# Altium project PCB_Project.PrjPcb
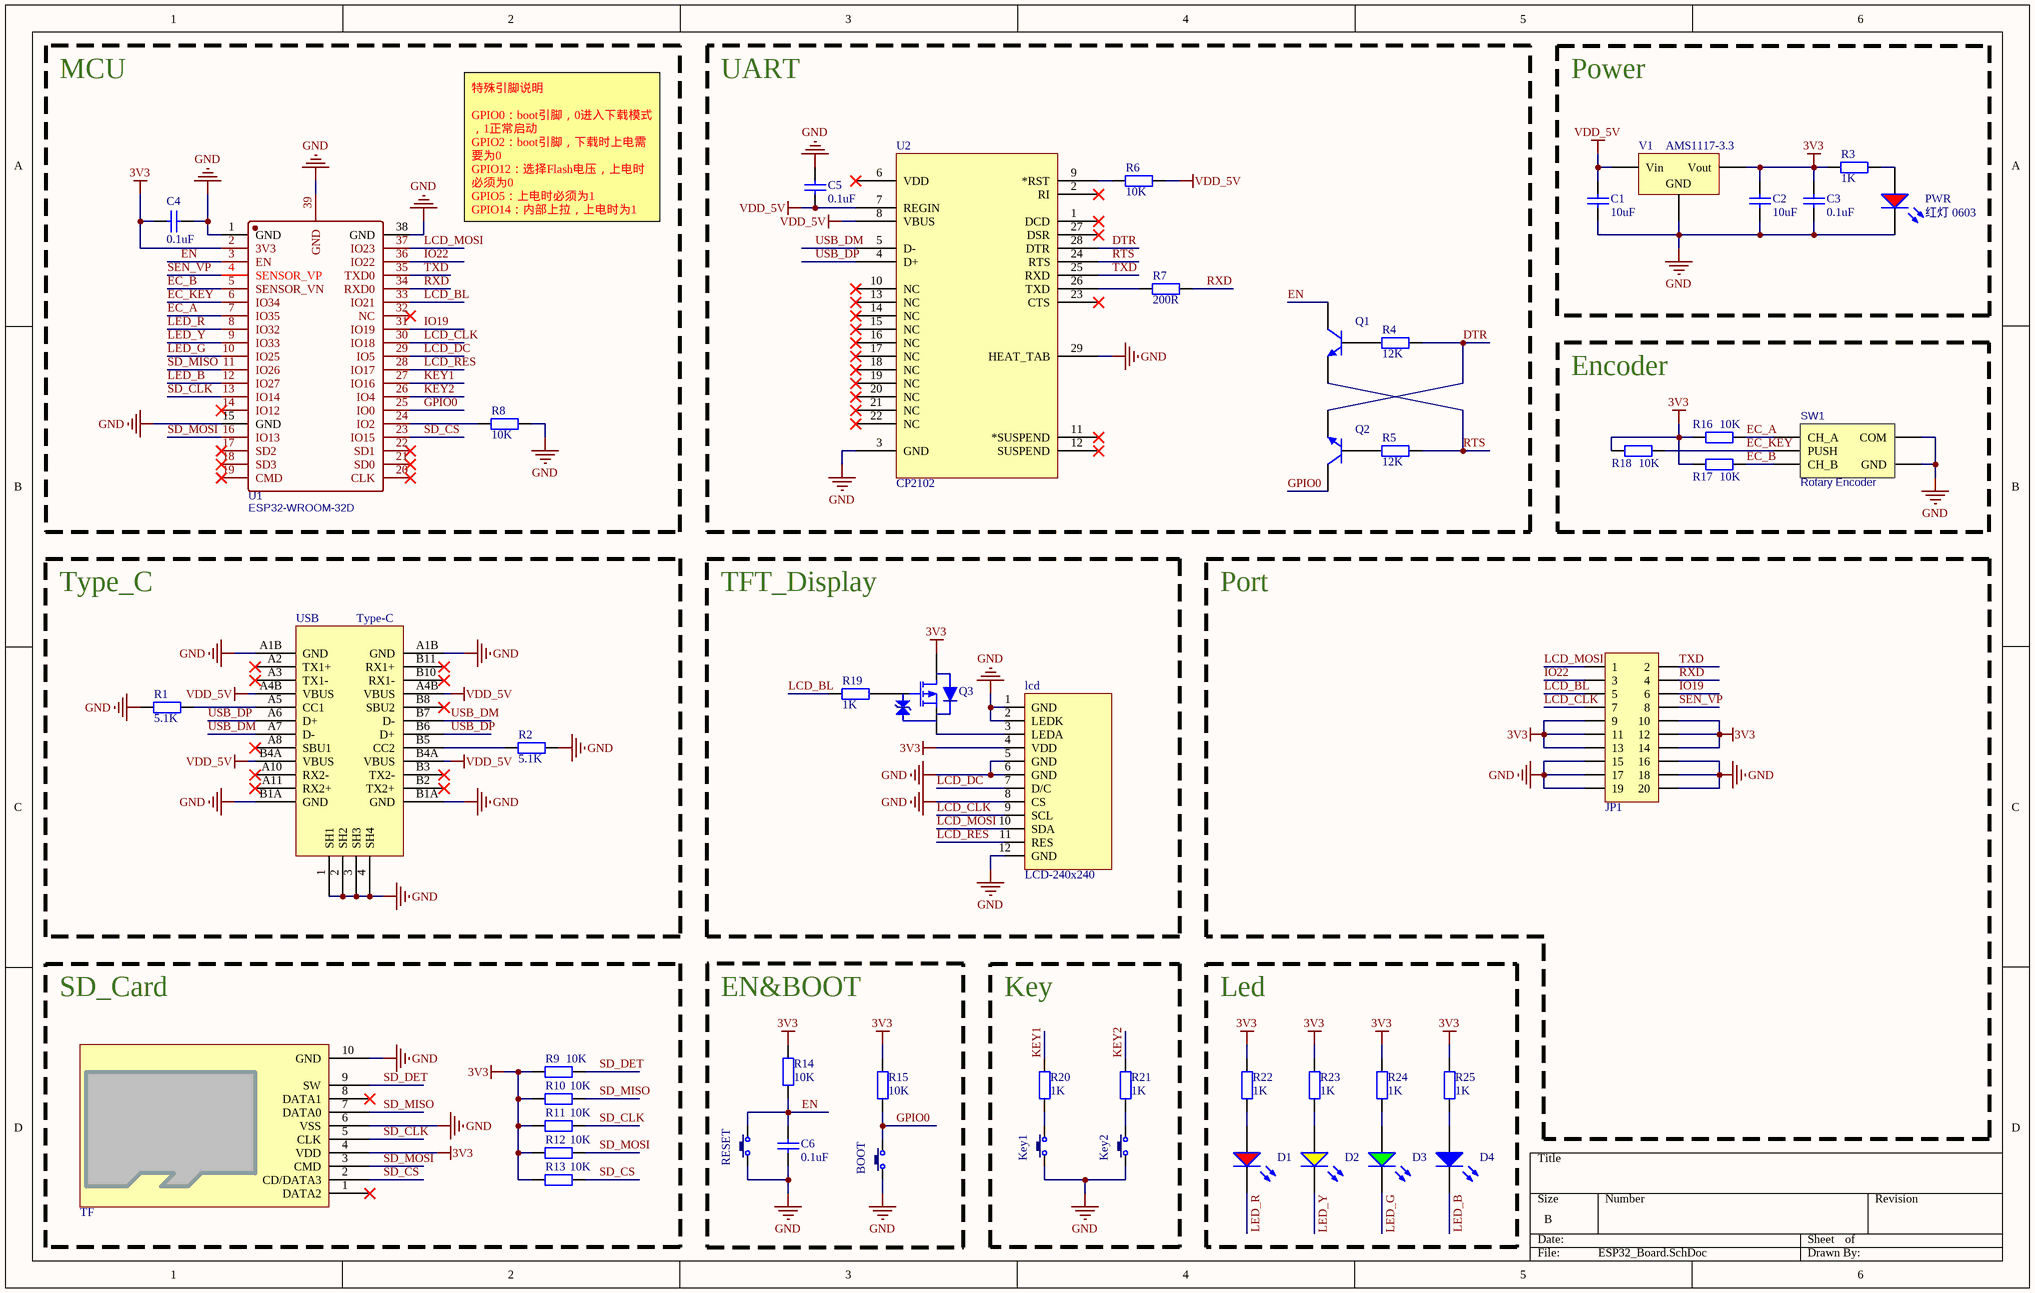
[diagram p0: ESP32_Board.SchDoc]
1 sheet, 51 parts. Net scope: global (net labels, ports and power ports of the same name join across sheets).
Board file: ESP32_Board_PCB.PcbDoc

## Sheet ESP32_Board.SchDoc
size B; SheetNumber: 1; SheetTotal: 1

### Parts
BOOT  3x6x5  [TSW SMD-6*6*5]  (value not drawn)
C1  10uF  [0603_C]
C2  10uF  [0603_C]
C3  0.1uF  [0603_C]
C4  0.1uF  [0603_C]
C5  0.1uF  [0603_C]
C6  0.1uF  [0603_C]
D1  红灯 0805  [0805_LED_S1]  (value not drawn)
D2  黄灯 0805  [0805_LED_S1]  (value not drawn)
D3  翠绿 0805  [0805_LED_S1]  (value not drawn)
D4  蓝灯 0805  [0805_LED_S1]  (value not drawn)
JP1  Header 2X10  [HDR2.54-M-LS-2x10P]  (value not drawn)
Key1  3x6x5  [TSW SMD-6*6*5]  (value not drawn)
Key2  3x6x5  [TSW SMD-6*6*5]  (value not drawn)
lcd  LCD-240x240  [LCD-240x240-NoHole]
PWR  红灯 0603  [0603_LED_S1]
Q1  SS8050 Y1  [SOT-23(SOT-23-3)]  (value not drawn)
Q2  SS8050 Y1  [SOT-23(SOT-23-3)]  (value not drawn)
Q3  AO3415A  [SOT23-3]  (value not drawn)
R1  5.1K  [0603_R]
R2  5.1K  [0603_R]
R3  1K  [0603_R]
R4  12K  [0603_R]
R5  12K  [0603_R]
R6  10K  [0603_R]
R7  200R  [0603_R]
R8  10K  [0603_R]
R9  10K  [0603_R]
R10  10K  [0603_R]
R11  10K  [0603_R]
R12  10K  [0603_R]
R13  10K  [0603_R]
R14  10K  [0603_R]
R15  10K  [0603_R]
R16  10K  [0603_R]
R17  10K  [0603_R]
R18  10K  [0603_R]
R19  1K  [0603_R]
R20  1K  [0603_R]
R21  1K  [0603_R]
R22  1K  [0603_R]
R23  1K  [0603_R]
R24  1K  [0603_R]
R25  1K  [0603_R]
RESET  3x6x5  [SW]  (value not drawn)
SW1  Rotary Encoder  [SIQ-02FVS3]
TF  TF  [Micro SD]  (value not drawn)
U1  ESP32-WROOM-32D  [WIFI-SMD_ESP32-WROOM-32E]
U2  CP2102  [QFN28 5x5_N]
USB  Type-C  [Type-C-TOP]
V1  AMS1117-3.3  [SOT-89]

### Blocks framed on the sheet
MCU: C4 R8 U1
UART: C5 Q1 Q2 R4-R7 U2
Power: C1-C3 PWR R3 V1
Encoder: R16-R18 SW1
Type_C: R1 R2 USB
TFT_Display: lcd Q3 R19
Port: JP1
SD_Card: R9-R13 TF
EN&BOOT: BOOT C6 R14 R15 RESET
Key: Key1 Key2 R20 R21
Led: D1-D4 R22-R25

### Nets
3V3: C2.2 C3.2 C4.2 JP1.9 JP1.10 JP1.11 JP1.12 JP1.13 JP1.14 lcd.4(VDD) Q3.3(D) R3.1 R9.1 R10.1 R11.1 R12.1 R13.1 R14.2 R15.2 R16.1 R17.1 R18.1 R22.1 R23.1 R24.1 R25.1 TF.4(VDD) U1.2(3V3) V1.2(Vout)
GND: BOOT.1 C1.1 C2.1 C3.1 C4.1 C5.2 C6.1 JP1.15 JP1.16 JP1.17 JP1.18 JP1.19 JP1.20 Key1.1 Key2.1 lcd.1(GND) lcd.2(LEDK) lcd.5(GND) lcd.6(GND) lcd.8(CS) lcd.12(GND) PWR.K R1.1 R2.2 R8.2 RESET.1 SW1.3(COM) SW1.5(GND) TF.6(VSS) TF.10(GND) U1.1(GND) U1.15(GND) U1.38(GND) U1.39(GND) U2.3(GND) U2.29(HEAT_TAB) USB.1(SH1) USB.2(SH2) USB.3(SH3) USB.4(SH4) USB.A1B(GND) USB.B1A(GND) V1.1(GND)
VDD_5V: C1.2 C5.1 R6.2 U2.7(REGIN) U2.8(VBUS) USB.A4B(VBUS) USB.B4A(VBUS) V1.3(Vin)
DTR: Q2.2(E) R4.2 U2.28(DTR)
EC_A: R16.2 SW1.1(CH_A) U1.7(IO35)
EC_B: R17.2 SW1.4(CH_B) U1.5(SENSOR_VN)
EC_KEY: R18.2 SW1.2(PUSH) U1.6(IO34)
EN: C6.2 Q1.3(C) R14.1 RESET.2 U1.3(EN)
GPIO0: BOOT.2 Q2.3(C) R15.1 U1.25(IO0)
IO19: JP1.6 U1.31(IO19)
IO22: JP1.3 U1.36(IO22)
KEY1: R20.2 U1.27(IO16)
KEY2: R21.2 U1.26(IO4)
LCD_BL: JP1.5 R19.1 U1.33(IO21)
LCD_CLK: JP1.7 lcd.9(SCL) U1.30(IO18)
LCD_DC: lcd.7(D/C) U1.29(IO5)
LCD_MOSI: JP1.1 lcd.10(SDA) U1.37(IO23)
LCD_RES: lcd.11(RES) U1.28(IO17)
LED_B: D4.K U1.12(IO27)
LED_G: D3.K U1.10(IO25)
LED_R: D1.K U1.8(IO32)
LED_Y: D2.K U1.9(IO33)
RTS: Q1.2(E) R5.2 U2.24(RTS)
RXD: JP1.4 R7.2 U1.34(RXD0)
SD_CLK: R11.2 TF.5(CLK) U1.13(IO14)
SD_CS: R13.2 TF.2(CD/DATA3) U1.23(IO15)
SD_DET: R9.2 TF.9(SW)
SD_MISO: R10.2 TF.7(DATA0) U1.11(IO26)
SD_MOSI: R12.2 TF.3(CMD) U1.16(IO13)
SEN_VP: JP1.8 U1.4(SENSOR_VP)
TXD: JP1.2 U1.35(TXD0) U2.25(RXD)
USB_DM: U2.5(D-) USB.A7(D-) USB.B7(D-)
USB_DP: U2.4(D+) USB.A6(D+) USB.B6(D+)
NetD1_A: D1.A R22.2
NetD2_A: D2.A R23.2
NetD3_A: D3.A R24.2
NetD4_A: D4.A R25.2
NetKey1_2: Key1.2 R20.1
NetKey2_2: Key2.2 R21.1
Netlcd_3: lcd.3(LEDA) Q3.2(S)
NetPWR_A: PWR.A R3.2
NetQ1_1: Q1.1(B) R4.1
NetQ2_1: Q2.1(B) R5.1
NetQ3_1: Q3.1(G) R19.2
NetR1_2: R1.2 USB.A5(CC1)
NetR2_1: R2.1 USB.B5(CC2)
NetR6_1: R6.1 U2.9(*RST)
NetR7_1: R7.1 U2.26(TXD)
NetR8_1: R8.1 U1.24(IO2)

Not connected (* = marked no-connect by the designer): TF 1(DATA2)* 8(DATA1)*; U1 14(IO12)* 17(SD2)* 18(SD3)* 19(CMD)* 20(CLK)* 21(SD0)* 22(SD1)* 32(NC)*; U2 1(DCD)* 2(RI)* 6(VDD)* 10(NC)* 11(*SUSPEND)* 12(SUSPEND)* 13(NC)* 14(NC)* 15(NC)* 16(NC)* 17(NC)* 18(NC)* 19(NC)* 20(NC)* 21(NC)* 22(NC)* 23(CTS)* 27(DSR)*; USB A2(TX1+)* A3(TX1-)* A8(SBU1)* A10(RX2-)* A11(RX2+)* B2(TX2+)* B3(TX2-)* B8(SBU2)* B10(RX1-)* B11(RX1+)*

### Notes on the sheet
- 特殊引脚说明
  GPIO0：boot引脚，0进入下载模式，1正常启动
  GPIO2：boot引脚，下载时上电需要为0
  GPIO12：选择Flash电压，上电时必须为0
  GPIO5：上电时必须为1
  GPIO14：内部上拉，上电时为1
  GPIO15：上电时必须为1

### Library data of the parts
BOOT Key1 Key2 RESET = TSW 3x6: 3x6轻触开关; 版权归属: 源创客; BOM名称: 3x6轻触开关; 学习资源: www.ooocke.com
C1-C4 = 0603 1.2nF (122) 10% 50V: 贴片电容; ComponentLink1Description: 供应商链接; ComponentLink1URL: http://www.szlcsc.com/product/details_31372.html; Package: 0603; Supplier: LC; SuppliersPartNumber: C30615
C5 = 0603 100nF (104) 10% 50V: 贴片电容; ComponentLink1Description: 供应商链接; ComponentLink1URL: http://www.szlcsc.com/product/details_15331.html; Package: 0603; Supplier: LC; SuppliersPartNumber: C14663
C6 = 0603 10uF (106) 10% 10V: 贴片电容; ComponentLink1Description: 供应商链接; ComponentLink1URL: http://www.szlcsc.com/product/details_20411.html; Package: 0603; Supplier: LC; SuppliersPartNumber: C19702
D1 = 0805 红灯: 发光二极管; ComponentLink1Description: 供应商链接; ComponentLink1URL: http://www.szlcsc.com/product/details_2668.html; Package: 0805; Supplier: LC; SuppliersPartNumber: C2295
D2 = 0805 黄灯: 发光二极管; ComponentLink1Description: 供应商链接; ComponentLink1URL: http://www.szlcsc.com/product/details_2669.html; Package: 0805; Supplier: LC; SuppliersPartNumber: C2296
D3 = 0805 翠绿: 发光二极管; ComponentLink1Description: 供应商链接; ComponentLink1URL: http://www.szlcsc.com/product/details_2670.html; Package: 0805; Supplier: LC; SuppliersPartNumber: C2297
D4 = 0805 蓝灯: 发光二极管; ComponentLink1Description: 供应商链接; ComponentLink1URL: http://www.szlcsc.com/product/details_2666.html; Package: 0805; Supplier: LC; SuppliersPartNumber: C2293
JP1 = Header 10X2: 10*2P接插件; 版权归属: 源创客; BOM名称: 10*2P接插件; 学习资源: www.ooocke.com
lcd = LCD-240x240: 显示屏
PWR = 0603 红灯: 发光二极管; ComponentLink1Description: 供应商链接; ComponentLink1URL: http://www.szlcsc.com/product/details_2659.html; Package: 0603; Supplier: LC; SuppliersPartNumber: C2286
Q1 Q2 = SOT-23 SS8050 Y1: 三极管; ComponentLink1Description: 供应商链接; ComponentLink1URL: http://www.szlcsc.com/product/details_2507.html; Package: SOT-23; Supplier: LC; SuppliersPartNumber: C2150
Q3 = AO3415A: MOSFET; Published: 8-Jun-2000; LatestRevisionDate: 17-Jul-2002; LatestRevisionNote: Re-released for DXP Platform.; PackageVersion: 1995/1996; PackageReference: E3; Publisher: Altium Limited; PackageDescription: TO, Flat Index; 3 In-Line, Axial Leads; Body Dia. 4.6mm; Lead Dia. 0.5 mm (max)
R1 R2 = 0603 1.1KΩ (1101) 1%: 贴片电阻; ComponentLink1Description: 供应商链接; ComponentLink1URL: http://www.szlcsc.com/product/details_23491.html; Package: 0603; Supplier: LC; SuppliersPartNumber: C22764
R3 = 0603 110KΩ (1103) 1%: 贴片电阻; ComponentLink1Description: 供应商链接; ComponentLink1URL: http://www.szlcsc.com/product/details_26548.html; Package: 0603; Supplier: LC; SuppliersPartNumber: C25805
R4-R7 R19-R25 = 0603 1.2KΩ (1201) 1%: 贴片电阻; ComponentLink1Description: 供应商链接; ComponentLink1URL: http://www.szlcsc.com/product/details_23492.html; Package: 0603; Supplier: LC; SuppliersPartNumber: C22765
R8 R15 = 0603 1.5KΩ (1501) 1%: 贴片电阻; ComponentLink1Description: 供应商链接; ComponentLink1URL: http://www.szlcsc.com/product/details_23570.html; Package: 0603; Supplier: LC; SuppliersPartNumber: C22843
R9-R13 R16-R18 = 0603 1.8MΩ (1804) 1%: 贴片电阻; ComponentLink1Description: 供应商链接; ComponentLink1URL: http://www.szlcsc.com/product/details_23579.html; Package: 0603; Supplier: LC; SuppliersPartNumber: C22852
R14 = 0603 100KΩ (1003) 1%: 贴片电阻; ComponentLink1Description: 供应商链接; ComponentLink1URL: http://www.szlcsc.com/product/details_26546.html; Package: 0603; Supplier: LC; SuppliersPartNumber: C25803
SW1 = Rotary Encoder: BOM_Manufacturer: ALPSALPINE; BOM_Manufacturer Part: EC11E1534443; Contributor: LCSC; BOM_Supplier: LCSC; BOM_Supplier Part: C1322543; BOM_JLCPCB Part Class: Extended Part; spicePre: S; spiceSymbolName: EC11E1534443
TF = TF卡座: 8脚自弹
U1 = ESP32_WROOM_32D: BOM_Manufacturer: Espressif Systems; BOM_Manufacturer Part: ESP32-WROOM-32E(8MB); Contributor: LCSC; BOM_Supplier: LCSC; BOM_Supplier Part: C701342; BOM_JLCPCB Part Class: Extended Part; spicePre: U; spiceSymbolName: ESP32-WROOM-32E(8MB)
U2 = CP2102: USB转TTL; PART DESC: SINGLE-CHIP USB TO UART BRIDGE, QFN28, RoHS.; MFG #1: SILICON LABS; PART NUMBER: CP2102; Value: Value; RefDes: RefDes; Type: DEV
USB = USB-Type-C-TOP
V1 = SOT-223 AMS1117-3.3: 低压差线性稳压(LDO); ComponentLink1Description: 供应商链接; ComponentLink1URL: http://www.szlcsc.com/product/details_6652.html; Package: SOT-223; Supplier: LC; SuppliersPartNumber: C6186